# Altium schematic sheet Sch3.SchDoc
size A4; SheetNumber: 6; SheetTotal: 6
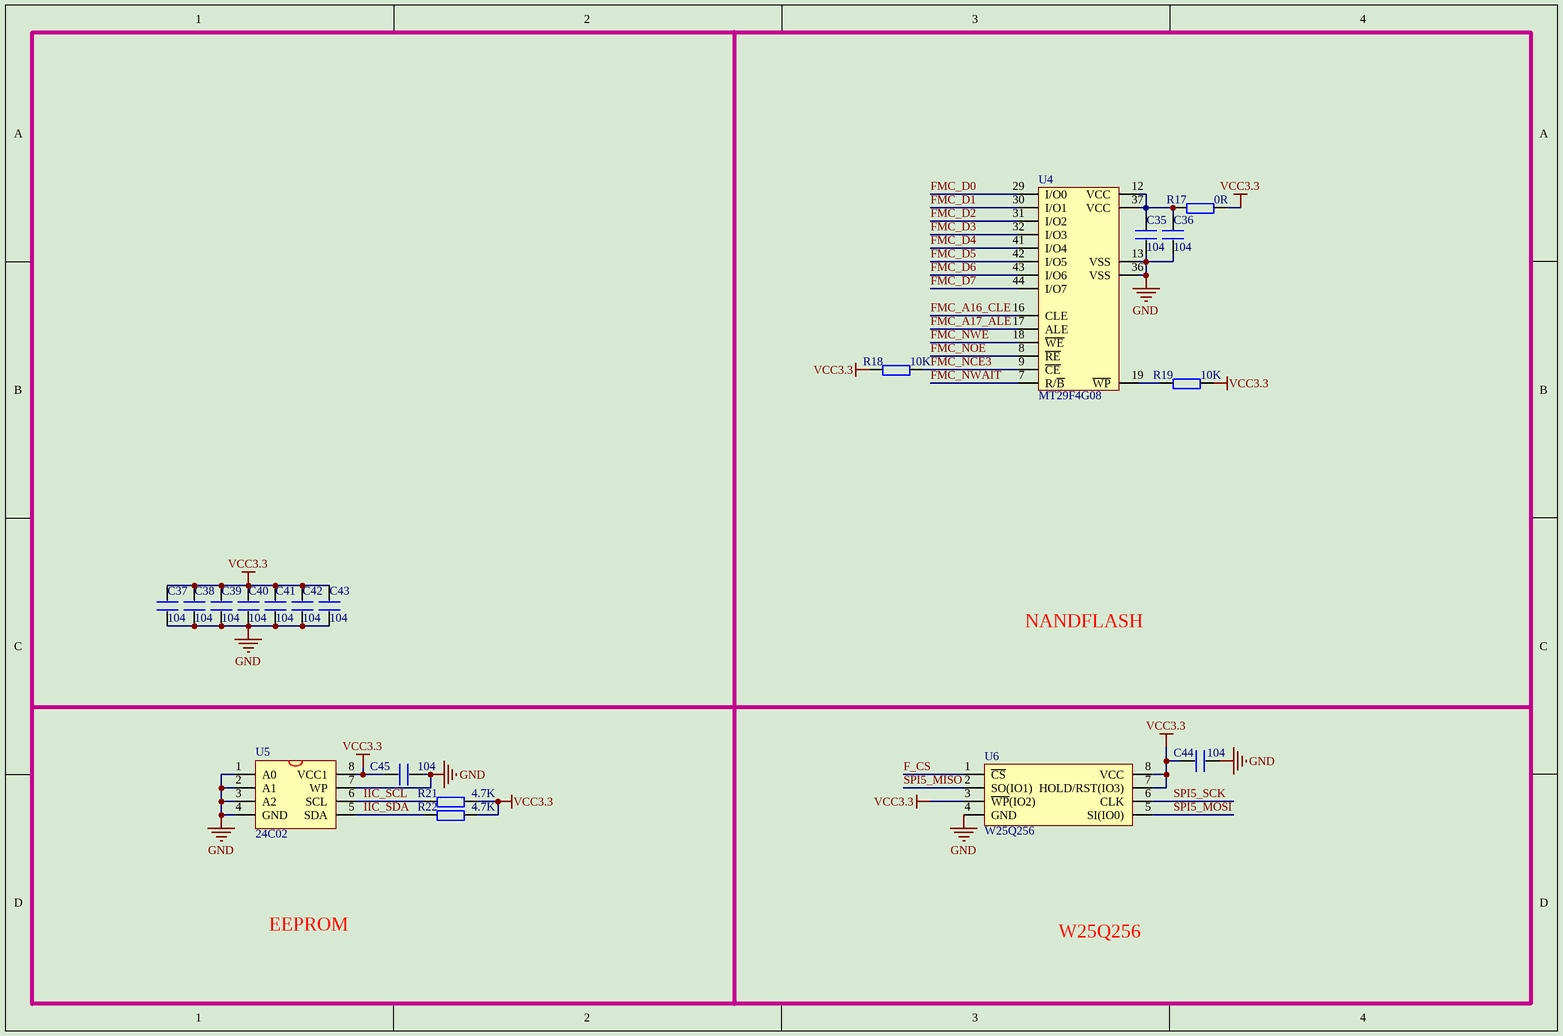
[diagram p0: Sch3.SchDoc]

## Parts
C35  104  [0402]
C36  104  [0402]
C37  104  [0402]
C38  104  [0402]
C39  104  [0402]
C40  104  [0402]
C41  104  [0402]
C42  104  [0402]
C43  104  [0402]
C44  104  [0402]
C45  104  [0402]
R17  0R  [0402]
R18  10K  [0402]
R19  10K  [0402]
R21  4.7K  [0402]
R22  4.7K  [0402]
U4  MT29F4G08  [TSOP48]
U5  24C02  [SOP-8]
U6  W25Q256  [WSON8]

## Nets
GND: C35.1 C36.1 C37.1 C38.1 C39.1 C40.1 C41.1 C42.1 C43.1 C44.2 C45.2 U4.13(VSS) U4.36(VSS) U5.1(A0) U5.2(A1) U5.3(A2) U5.4(GND) U5.7(WP) U6.4(GND)
VCC3.3: C37.2 C38.2 C39.2 C40.2 C41.2 C42.2 C43.2 C44.1 C45.1 R17.2 R18.1 R19.2 R21.2 R22.2 U5.8(VCC1) U6.3(~{WP}(IO2)) U6.7(HOLD/RST(IO3)) U6.8(VCC)
F_CS: U6.1(~{CS})
FMC_A16_CLE: U4.16(CLE)
FMC_A17_ALE: U4.17(ALE)
FMC_D0: U4.29(I/O0)
FMC_D1: U4.30(I/O1)
FMC_D2: U4.31(I/O2)
FMC_D3: U4.32(I/O3)
FMC_D4: U4.41(I/O4)
FMC_D5: U4.42(I/O5)
FMC_D6: U4.43(I/O6)
FMC_D7: U4.44(I/O7)
FMC_NCE3: R18.2 U4.9(~{CE})
FMC_NOE: U4.8(~{RE})
FMC_NWAIT: U4.7(R/~{B})
FMC_NWE: U4.18(~{WE})
IIC_SCL: R21.1 U5.6(SCL)
IIC_SDA: R22.1 U5.5(SDA)
SPI5_MISO: U6.2(SO(IO1))
SPI5_MOSI: U6.5(SI(IO0))
SPI5_SCK: U6.6(CLK)
NetC35_2: C35.2 C36.2 R17.1 U4.12(VCC) U4.37(VCC)
NetR19_1: R19.1 U4.19(~{WP})

## Notes on the sheet
- NANDFLASH
- EEPROM
- W25Q256

## Library data of the parts
C35-C45 = C
R17-R19 R21 R22 = R
U4 = K9F2G08U0C: 256MB NAND FLASH
U5 = 24C256: EEPROM
U6 = W25Q128